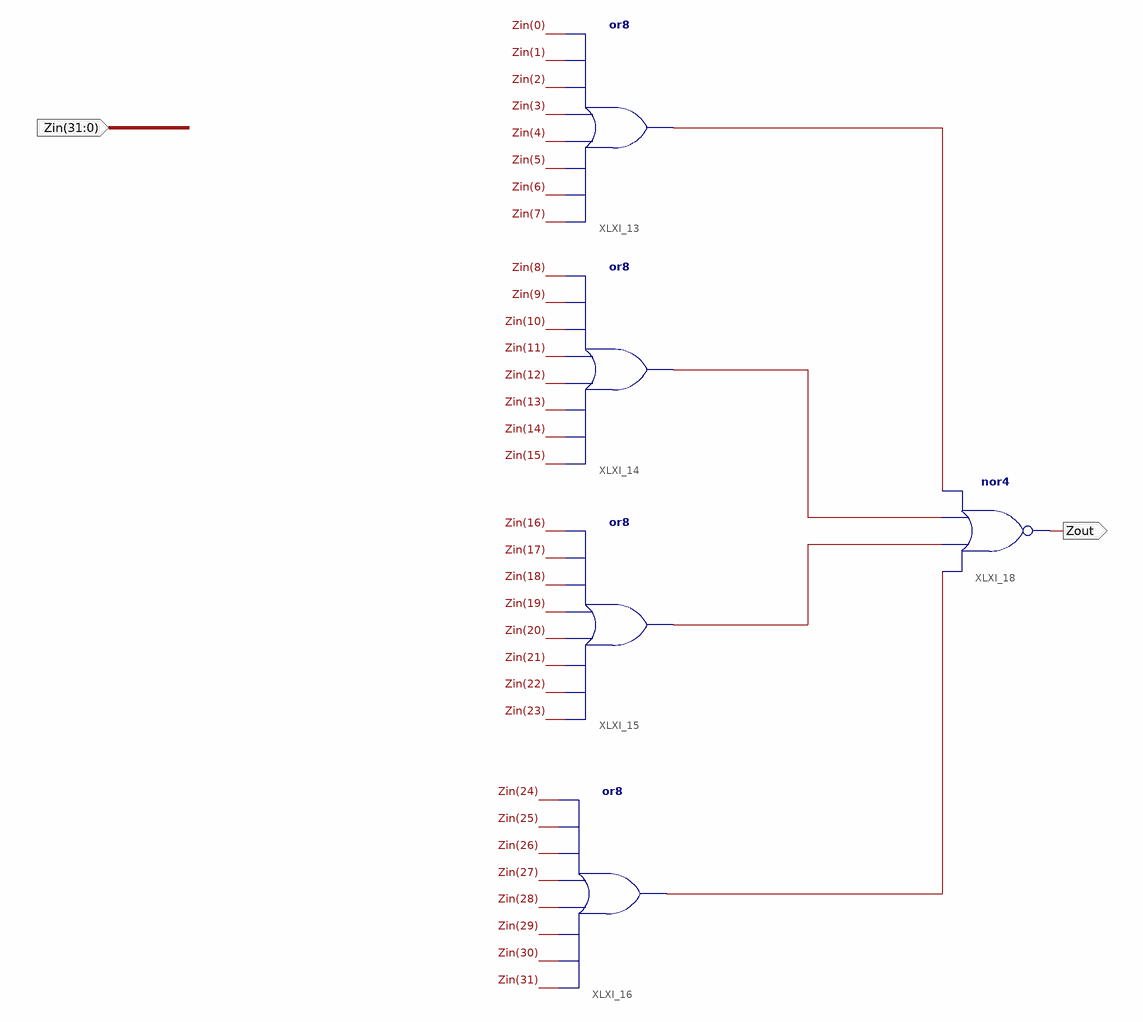
[diagram p0: schematic sheet 1]
// Xilinx ISE schematic zero.sch (spartan3) as structural Verilog: 5 symbols, 2 ports
module zero (
  input  [31:0] Zin,
  output Zout
);

  wire XLXN_1, XLXN_48, XLXN_49, XLXN_50;

  or XLXI_13 (XLXN_1, Zin[7], Zin[6], Zin[5], Zin[4], Zin[3], Zin[2], Zin[1], Zin[0]);
  or XLXI_14 (XLXN_48, Zin[15], Zin[14], Zin[13], Zin[12], Zin[11], Zin[10], Zin[9], Zin[8]);
  or XLXI_15 (XLXN_49, Zin[23], Zin[22], Zin[21], Zin[20], Zin[19], Zin[18], Zin[17], Zin[16]);
  or XLXI_16 (XLXN_50, Zin[31], Zin[30], Zin[29], Zin[28], Zin[27], Zin[26], Zin[25], Zin[24]);
  nor XLXI_18 (Zout, XLXN_50, XLXN_49, XLXN_48, XLXN_1);
endmodule
